# EAGLE schematic charging_1batt (EAGLE 8.2.0)
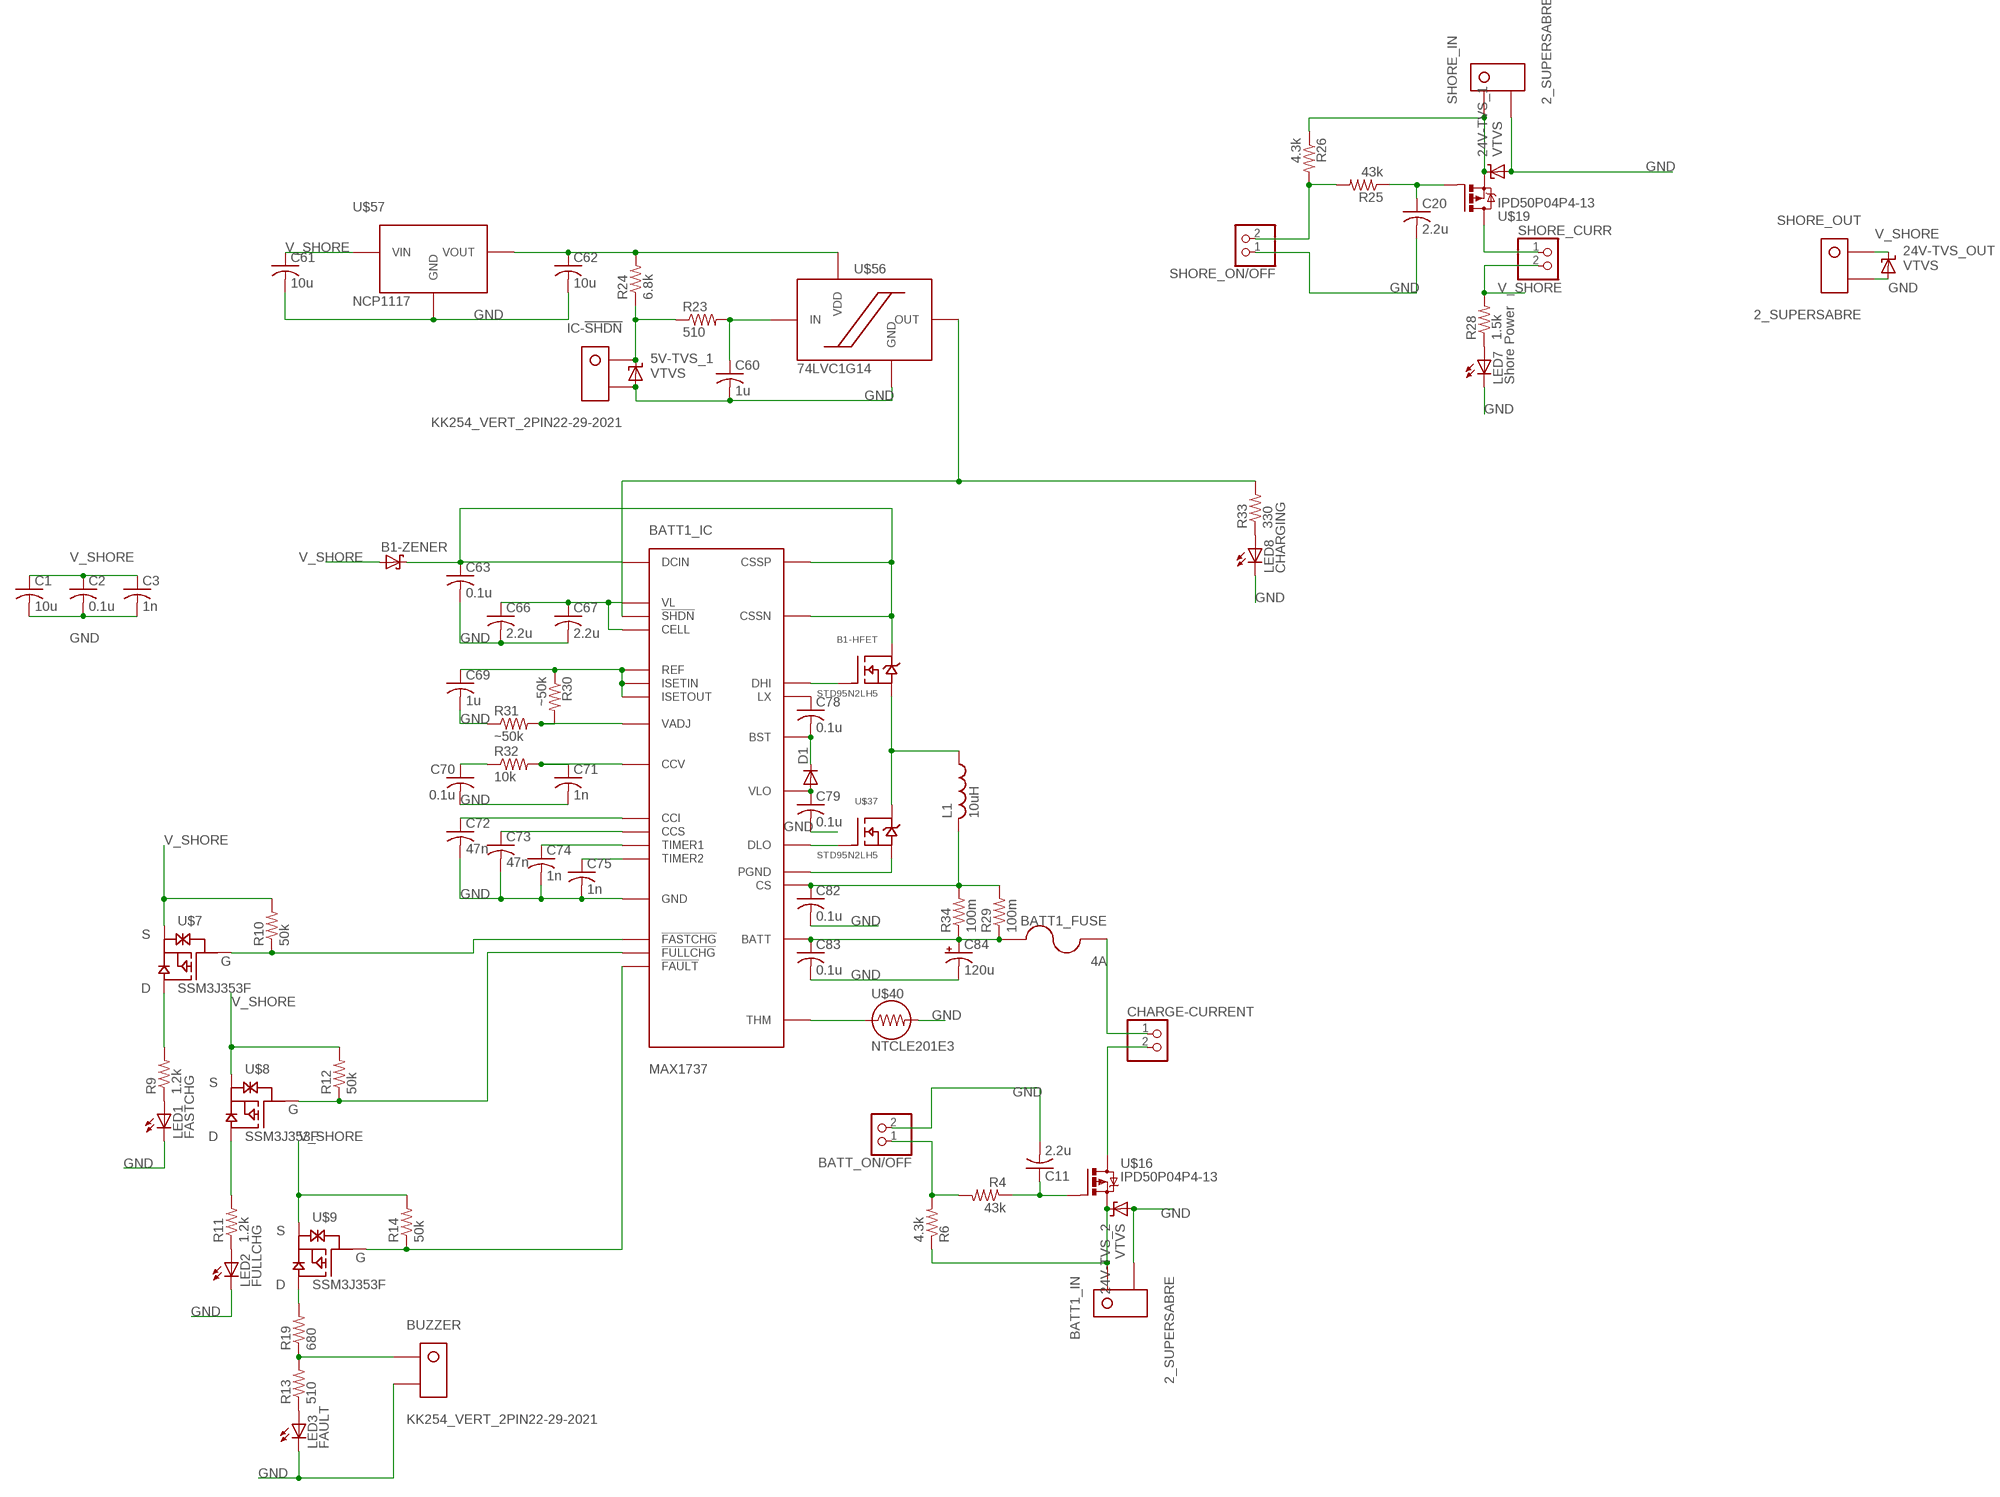
[diagram p0: schematic, sheet 1]

## Parts
5V-TVS_1  VTVS  [DO-219AB]
24V-TVS_1  VTVS  [DO-219AB]
24V-TVS_2  VTVS  [DO-219AB]
24V-TVS_OUT  VTVS  [DO-219AB]
B1-HFET  STD95N2LH5  [DPAK]
B1-ZENER  SCHOTTKY-DIODESOD-106  [SOD106-R]
BATT1_FUSE  4A  154-OMNI_BLOK  [154-OMNI-BLOK]
BATT1_IC  MAX1737  [QSOP28]
BATT1_IN  2_SUPERSABRE  [SUPERSABRE_2CIRCUIT]
BATT_ON/OFF  PINHD-1X2  [1X02]
BUZZER  KK254_VERT_2PIN22-29-2021  [KK254_VERT_2PIN]
C1  10u  C-USC0805  [C0805]
C2  0.1u  C-USC0805  [C0805]
C3  1n  C-USC0805  [C0805]
C11  2.2u  C-USC0805  [C0805]
C20  2.2u  C-USC0805  [C0805]
C60  1u  C-USC0805  [C0805]
C61  10u  C-USC0805  [C0805]
C62  10u  C-USC0805  [C0805]
C63  0.1u  C-USC0805  [C0805]
C66  2.2u  C-USC0805  [C0805]
C67  2.2u  C-USC0805  [C0805]
C69  1u  C-USC0805  [C0805]
C70  0.1u  C-USC0805  [C0805]
C71  1n  C-USC0805  [C0805]
C72  47n  C-USC0805  [C0805]
C73  47n  C-USC0805  [C0805]
C74  1n  C-USC0805  [C0805]
C75  1n  C-USC0805  [C0805]
C78  0.1u  C-USC0805  [C0805]
C79  0.1u  C-USC0805  [C0805]
C82  0.1u  C-USC0805  [C0805]
C83  0.1u  C-USC0805  [C0805]
C84  120u  CPOL-USE3.5-8  [E3,5-8]
CHARGE-CURRENT  PINHD-1X2  [1X02]
D1  DIODE-SOD123  [SOD123]
IC-!SHDN!  KK254_VERT_2PIN22-29-2021  [KK254_VERT_2PIN]
L1  10uH  L-USL6100  [L6100]
LED1  FASTCHG  LEDCHIP-LED0805  [CHIP-LED0805]
LED2  FULLCHG  LEDCHIP-LED0805  [CHIP-LED0805]
LED3  FAULT  LEDCHIP-LED0805  [CHIP-LED0805]
LED7  Shore Power  LEDCHIP-LED0805  [CHIP-LED0805]
LED8  CHARGING  LEDCHIP-LED0805  [CHIP-LED0805]
R4  43k  R-US_R0805  [R0805]
R6  4.3k  R-US_R0805  [R0805]
R9  1.2k  R-US_R0805  [R0805]
R10  50k  R-US_R0805  [R0805]
R11  1.2k  R-US_R0805  [R0805]
R12  50k  R-US_R0805  [R0805]
R13  510  R-US_R0805  [R0805]
R14  50k  R-US_R0805  [R0805]
R19  680  R-US_R0805  [R0805]
R23  510  R-US_R0805  [R0805]
R24  6.8k  R-US_R0805  [R0805]
R25  43k  R-US_R0805  [R0805]
R26  4.3k  R-US_R0805  [R0805]
R28  1.5k  R-US_R0805  [R0805]
R29  100m  R-US_R2512  [R2512]
R30  ~50k  R-US_R0805  [R0805]
R31  ~50k  R-US_R0805  [R0805]
R32  10k  R-US_R0805  [R0805]
R33  330  R-US_R0805  [R0805]
R34  100m  R-US_R2512  [R2512]
SHORE_CURR  PINHD-1X2  [1X02]
SHORE_IN  2_SUPERSABRE  [SUPERSABRE_2CIRCUIT]
SHORE_ON/OFF  PINHD-1X2  [1X02]
SHORE_OUT  2_SUPERSABRE  [SUPERSABRE_2CIRCUIT]
U$7  SSM3J353F  [SOT-346-3/S-MINI]
U$8  SSM3J353F  [SOT-346-3/S-MINI]
U$9  SSM3J353F  [SOT-346-3/S-MINI]
U$16  IPD50P04P4-13  [TO252-3]
U$19  IPD50P04P4-13  [TO252-3]
U$37  STD95N2LH5  [DPAK]
U$40  NTCLE201E3  [2-0.3MM-LEADS]
U$56  74LVC1G14  [TSSOP5]
U$57  NCP1117  [SOT-223]

## Nets
!SHDN!: BATT1_IC.18(!SHDN!) R33.2 U$56.P$4(OUT)
BATT1_P: 24V-TVS_2.P$2(C) BATT1_IN.P$1 R6.1 U$16.TAB(D)
BATT_1: BATT1_FUSE.P$2 BATT1_IC.7(BATT) C83.1 C84.+ R29.1 R34.1
CS_1: BATT1_IC.19(CS) C82.1 L1.P$2 R29.2 R34.2
FET-G_1: C11.1 R4.1 U$16.1(G)
GND: 5V-TVS_1.P$1(A) 24V-TVS_1.P$1(A) 24V-TVS_2.P$1(A) 24V-TVS_OUT.P$1(A) BATT1_IC.6(GND) BATT1_IN.P$2 BATT_ON/OFF.2 BUZZER.P$2 C1.2 C2.2 C3.2 C11.2 C20.2 C60.2 C61.2 C62.2 C63.2 C66.2 C67.2 C69.2 C70.2 C71.2 C72.2 C73.2 C74.2 C75.2 C79.2 C82.2 C83.2 C84.- IC-!SHDN!.P$2 LED1.C LED2.C LED3.C LED7.C LED8.C R31.1 SHORE_IN.P$2 SHORE_ON/OFF.1 SHORE_OUT.P$2 U$40.P$2 U$56.P$3(GND) U$57.P$1(GND)
N$1: CHARGE-CURRENT.2 U$16.3(S)
N$2: LED1.A R9.1
N$3: BATT1_FUSE.P$1 CHARGE-CURRENT.1
N$4: SHORE_CURR.1 U$19.3(S)
N$12: LED3.A R13.1
N$22: LED2.A R11.1
N$23: R9.2 U$7.P$2(D)
N$24: BATT1_IC.16(!FASTCHG!) R10.1 U$7.P$1(G)
N$26: R11.2 U$8.P$2(D)
N$27: BATT1_IC.17(!FULLCHG!) R12.1 U$8.P$1(G)
N$29: BUZZER.P$1 R13.2 R19.1
N$30: R19.2 U$9.P$2(D)
N$31: BATT1_IC.15(!FAULT!) R14.1 U$9.P$1(G)
N$35: LED7.A R28.1
N$40: B1-HFET.TAB(D) B1-ZENER.C BATT1_IC.26(CSSN) BATT1_IC.27(CSSP) BATT1_IC.28(DCIN) C63.1
N$47: C20.1 R25.1 U$19.1(G)
N$49: C60.1 R23.2 U$56.P$2(IN)
N$50: 5V-TVS_1.P$2(C) IC-!SHDN!.P$1 R23.1 R24.1
N$51: R25.2 R26.2 SHORE_ON/OFF.2
N$52: BATT_ON/OFF.1 R4.2 R6.2
N$54: C62.1 R24.2 U$56.P$5(VDD) U$57.P$2(VOUT) U$57.P$4(VOUT)
N$57: LED8.A R33.1
N$62: BATT1_IC.8(VADJ) R30.2 R31.2
N$64: C70.1 R32.1
N$65: BATT1_IC.1(VL) BATT1_IC.12(CELL) C66.1 C67.1
N$67: BATT1_IC.9(CCV) C71.1 R32.2
N$68: BATT1_IC.2(ISETIN) BATT1_IC.3(ISETOUT) BATT1_IC.5(REF) C69.1 R30.1
N$69: BATT1_IC.11(CCI) C72.1
N$70: BATT1_IC.10(CCS) C73.1
N$71: BATT1_IC.13(TIMER1) C74.1
N$72: BATT1_IC.14(TIMER2) C75.1
N$75: BATT1_IC.24(LX) C78.1
N$76: BATT1_IC.23(BST) C78.2 D1.C
N$79: BATT1_IC.21(DLO) U$37.1(G)
N$80: B1-HFET.1(G) BATT1_IC.25(DHI)
N$81: B1-HFET.3(S) L1.P$1 U$37.TAB(D)
N$82: BATT1_IC.20(PGND) U$37.3(S)
N$83: BATT1_IC.22(VLO) C79.1 D1.A
N$84: BATT1_IC.4(THM) U$40.P$1
V_SHORE: 24V-TVS_OUT.P$2(C) B1-ZENER.A C1.1 C2.1 C3.1 C61.1 R10.2 R12.2 R14.2 R28.2 SHORE_CURR.2 SHORE_OUT.P$1 U$7.P$3(S) U$8.P$3(S) U$9.P$3(S) U$57.P$3(VIN)
VIN: 24V-TVS_1.P$2(C) R26.1 SHORE_IN.P$1 U$19.TAB(D)

## Library data of the parts
5V-TVS_1 24V-TVS_1 24V-TVS_2 24V-TVS_OUT = diode:VTVS: Vishay VTVS5V0ASMF to VTVS63GSMF 400W TVS diodes Datasheet <http://www.mouser.com/ds/2/427/vtvs5v0asmf-1078013.pdf>
B1-HFET U$37 = transistors:STD95N2LH5: ST STD95N2LH5 NMOS Power FET Datasheet <http://www.mouser.com/ds/2/389/std95n2lh5-955773.pdf>
B1-ZENER = diode:SCHOTTKY-DIODE: Schottky Diode
BATT1_FUSE = littelfuse:154-OMNI_BLOK: Littelfuse NANO2 Series 154 Omni-Blok fuseholder Datasheet <http://www.mouser.com/ds/2/240/Littelfuse_Fuse_154_154T_154L_154TL_Datasheet.pdf-309941.pdf>
BATT1_IC = maxim:MAX1737: Maxim MAX1737 Stand-Alone Switch-Mode Lithium-Ion Battery-Charger Controller 1-4 cell LiPo charge controller IC Datasheet <https://datasheets.maximintegrated.com/en/ds/MAX1737.pdf>
BATT1_IN SHORE_IN SHORE_OUT = molex:2_SUPERSABRE: Molex SuperSabre 2-pin vertical header
BATT_ON/OFF CHARGE-CURRENT SHORE_CURR SHORE_ON/OFF = pinhead:PINHD-1X2: PIN HEADER
BUZZER IC-!SHDN! = molex:KK254_VERT_2PIN: KK® 254 Wire-to-Board Header, Vertical, with Friction Lock, 2 Circuits, Gold (Au) Plating Part Number: 22-29-2021 http://www.molex.com/molex/products/datasheet.jsp?part=active/0022292021_PCB_HEADERS.xml
C1-C3 C11 C20 C60-C63 C66 C67 C69-C75 C78 C79 C82 C83 = resistor:C-US: CAPACITOR, American symbol
C84 = resistor:CPOL-US: POLARIZED CAPACITOR, American symbol
D1 = diode:DIODE-: DIODE
L1 = resistor:L-US: INDUCTOR, American symbol
LED1-LED3 LED7 LED8 = led:LED: LED OSRAM: - CHIPLED LG R971, LG N971, LY N971, LG Q971, LY Q971, LO R971, LY R971 LH N974, LH R974 LS Q976, LO Q976, LY Q976 LO Q996 - Hyper CHIPLED LW Q18S LB Q993, LB Q99A, LB R99A - SideLED LS A670, LO A670, LY A670, LG A670, LP A670 LB A673, LV A673, LT A673, LW A673 LH A674 LY A675 LS A676, LA A676, LO A676, LY A676, LW A676 LS A679, LY A679, LG A679 - Hyper Micro SIDELED® LS Y876, LA Y876, LO Y876, LY Y876 LT Y87S - SmartLED LW L88C, LW L88S LB L89C, LB L89S, LG L890 LS L89K, LO L89K, LY L89K LS L896, LA L896, LO L896, LY L896 - TOPLED LS T670, LO T670, LY T670, LG T670, LP T670 LSG T670, LSP T670, LSY T670, LOP T670, LYG T670 LG T671, LOG T671, LSG T671 LB T673, LV T673, LT T673, LW T673 LH T674 LS T676, LA T676, LO T676, LY T676, LB T676, LH T676, LSB T676, LW T676 LB T67C, LV T67C, LT T67C, LS T67K, LO T67K, LY T67K, LW E67C LS E67B, LA E67B, LO E67B, LY E67B, LB E67C, LV E67C, LT E67C LW T67C LS T679, LY T679, LG T679 LS T770, LO T770, LY T770, LG T770, LP T770 LB T773, LV T773, LT T773, LW T773 LH T774 LS E675, LA E675, LY E675, LS T675 LS T776, LA T776, LO T776, LY T776, LB T776 LHGB T686 LT T68C, LB T68C - Hyper Mini TOPLED® LB M676 - Mini TOPLED Santana® LG M470 LS M47K, LO M47K, LY M47K Source: http://www.osram.convergy.de LUXEON: - LUMILED® LXK2-PW12-R00, LXK2-PW12-S00, LXK2-PW14-U00, LXK2-PW14-V00 LXK2-PM12-R00, LXK2-PM12-S00, LXK2-PM14-U00 LXK2-PE12-Q00, LXK2-PE12-R00, LXK2-PE12-S00, LXK2-PE14-T00, LXK2-PE14-U00 LXK2-PB12-K00, LXK2-PB12-L00, LXK2-PB12-M00, LXK2-PB14-N00, LXK2-PB14-P00, LXK2-PB14-Q00 LXK2-PR12-L00, LXK2-PR12-M00, LXK2-PR14-Q00, LXK2-PR14-R00 LXK2-PD12-Q00, LXK2-PD12-R00, LXK2-PD12-S00 LXK2-PH12-R00, LXK2-PH12-S00 LXK2-PL12-P00, LXK2-PL12-Q00, LXK2-PL12-R00 Source: www.luxeon.com KINGBRIGHT: KA-3528ASYC Source: www.kingbright.com
R4 R6 R9-R14 R19 R23-R26 R28-R34 = resistor:R-US_: RESISTOR, American symbol
U$7-U$9 = transistors:SSM3J353F: Toshiba SSM3J353F Small signal PMOS Datasheet <http://www.mouser.com/ds/2/408/SSM3J353F_datasheet_en_20161219-981025.pdf>
U$16 U$19 = transistor-power:IPD50P04P4-13: Infineon IPD50P04P4-13 OptiMOS®-P2 Power-Transistor Datasheet <http://www.mouser.com/ds/2/196/Infineon-IPD50P04P4-13-DS-v01_02-EN-336147.pdf>
U$40 = vishay:NTCLE201E3: Vishay NTC Thermistor Part No. NTCLE201E3 Datasheet <http://www.mouser.com/ds/2/427/ntclesb-278158.pdf>
U$56 = NXP:74LVC1G14: Nexperia 74LVC1G14 Single Schmitt trigger inverter Datasheet <http://www.mouser.com/ds/2/302/74LVC1G14_Q100-839654.pdf>
U$57 = ONSemi:NCP1117: ON Semiconductor NCP1117 5V 1A Fixed LDO Datasheet <http://www.mouser.com/ds/2/308/NCP1117-D-81326.pdf>